# EAGLE design CallerID_V12 (EAGLE 9.3.0)
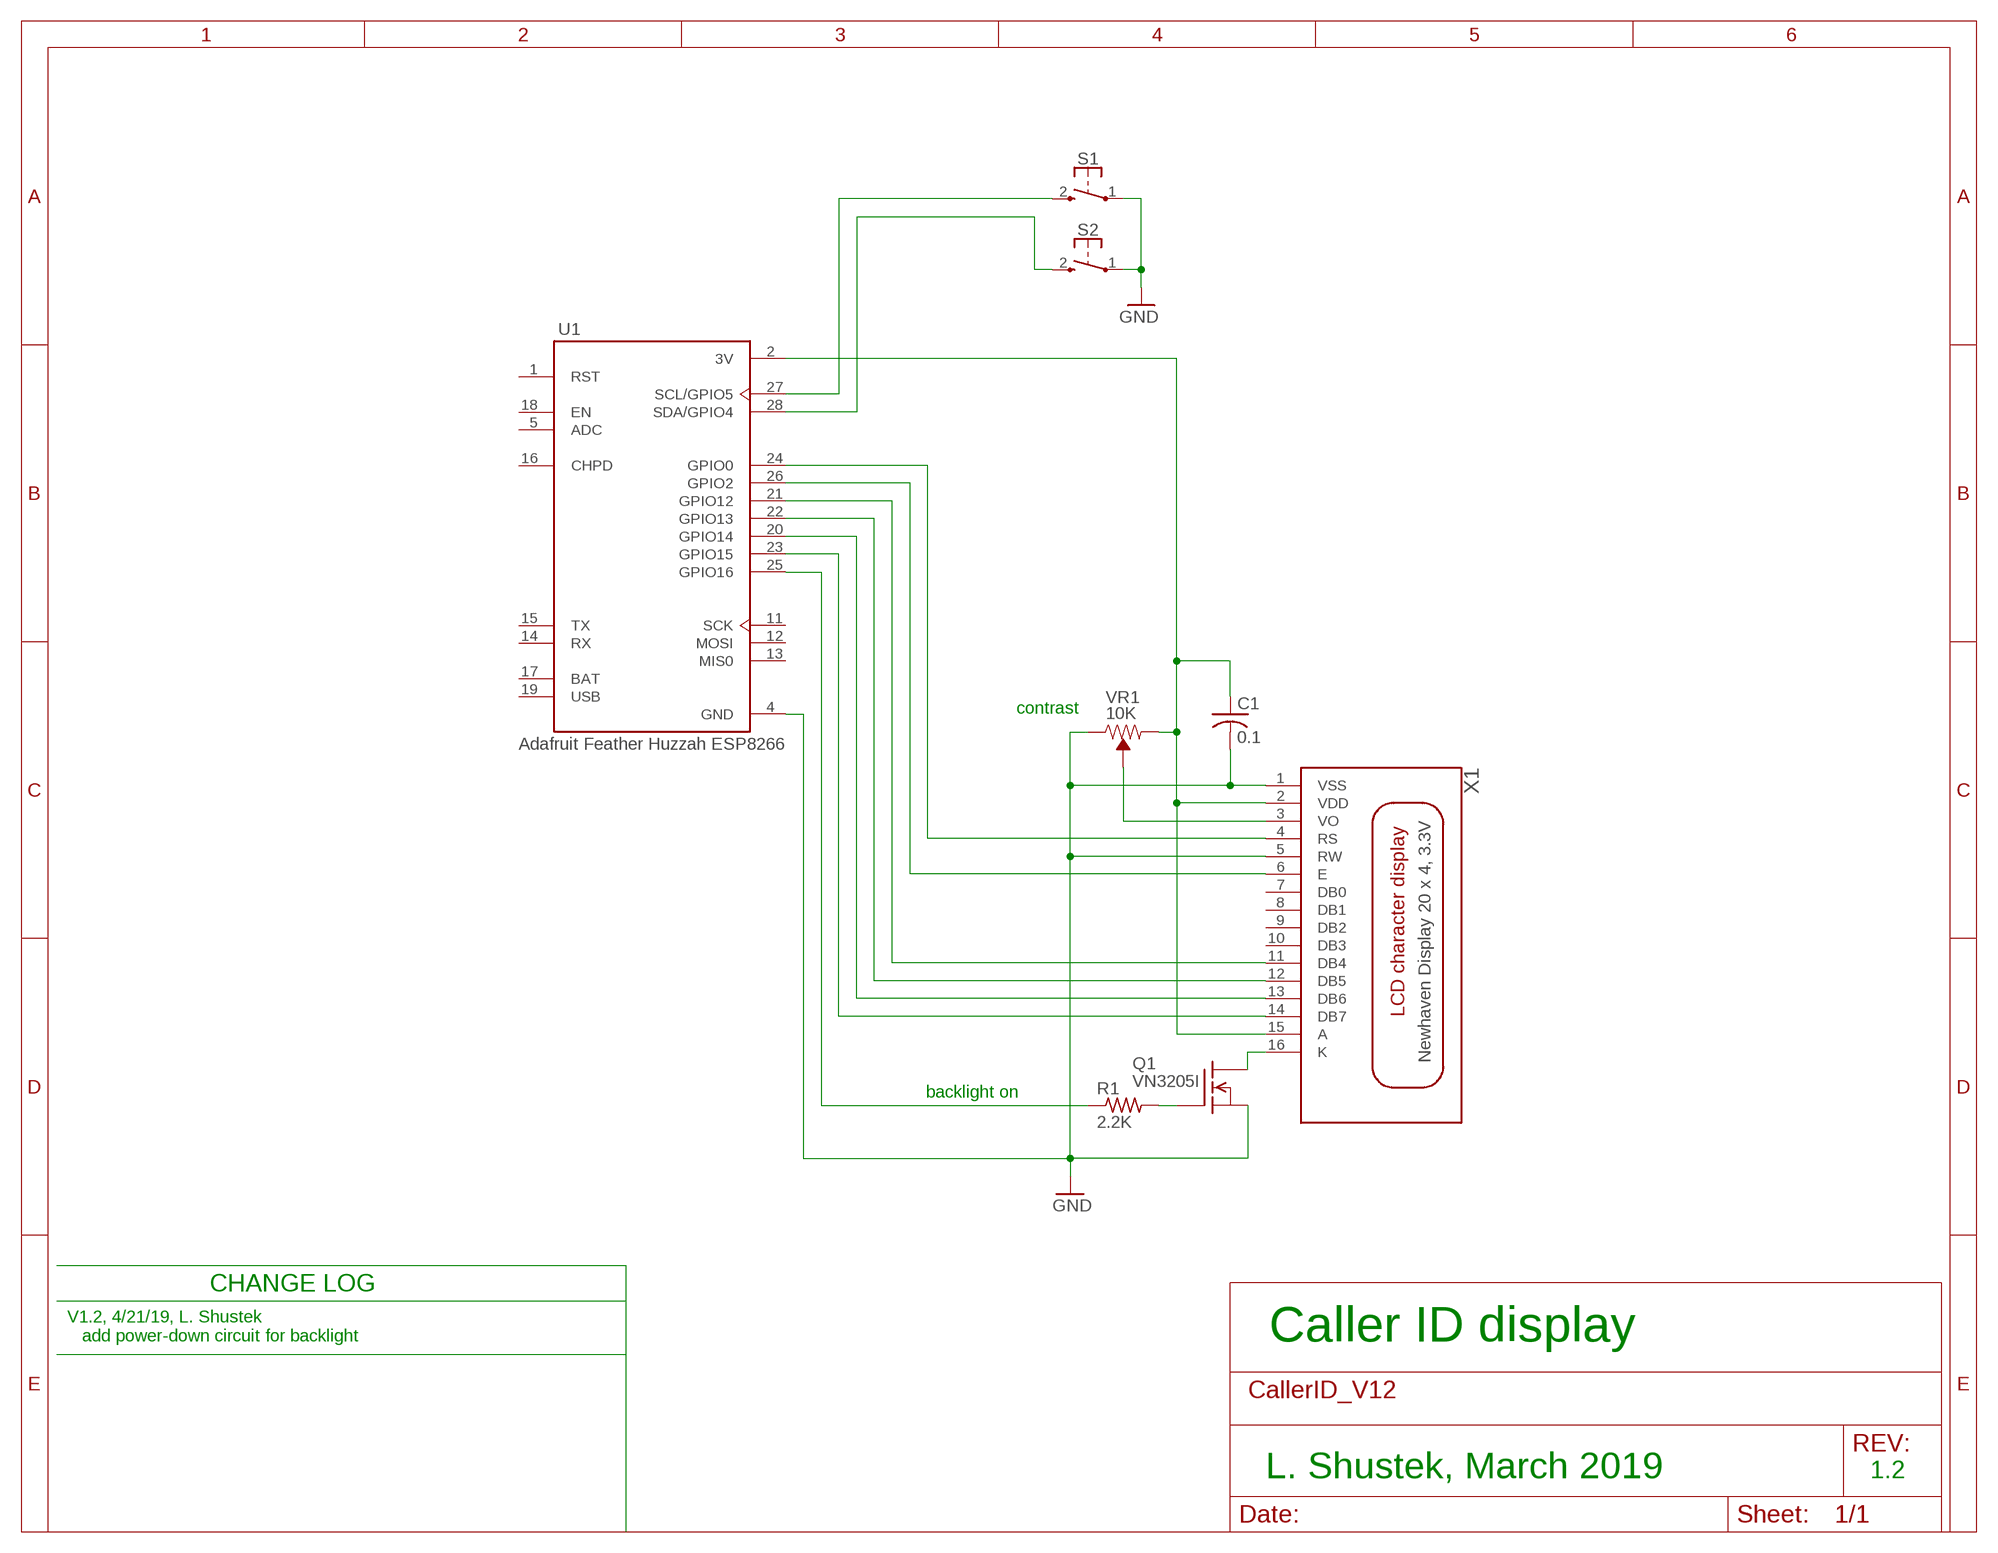
[diagram p0: schematic, sheet 1]

## Parts
C1  0.1  C-US050-024X044  [C050-024X044]
Q1  VN3205I  [TO92-INLINE]
R1  2.2K  R-US_0207/10  [0207/10]
S1  PUSHBUTTON-SPST  [PUSHBUTTON-SPST]
S2  PUSHBUTTON-SPST  [PUSHBUTTON-SPST]
U1  Adafruit Feather Huzzah ESP8266  ADAFRUIT-FEATHER-WIFI  [ADAFRUIT-FEATHER-WIFI]
VR1  10K  TRIMPOT  [TRIMBOT-BOURNS-3362M]
X1  Newhaven Display 20 x 4, 3.3V  LCD-CHARACTER-DISPLAYLCD-CHARACTER-DISPLAY-20X4-NEWHAVEN  [LCD-CHARACTER-DISPLAY-20X4-NEWHAVEN]

## Nets
GND: C1.2 Q1.1(S) S1.1 S2.1 U1.4(GND) VR1.3(CW) X1.1(VSS) X1.5(RW)
N$1: VR1.2(WIPER) X1.3(VO)
N$2: Q1.3(D) X1.16(K)
N$3: S1.2 U1.27(SCL/GPIO5)
N$4: S2.2 U1.28(SDA/GPIO4)
N$5: U1.23(GPIO15) X1.14(DB7)
N$6: U1.20(GPIO14) X1.13(DB6)
N$7: U1.22(GPIO13) X1.12(DB5)
N$8: U1.21(GPIO12) X1.11(DB4)
N$9: U1.26(GPIO2) X1.6(E)
N$10: U1.24(GPIO0) X1.4(RS)
N$11: R1.1 U1.25(GPIO16)
N$12: Q1.2(G) R1.2
VDD: C1.1 U1.2(3V) VR1.1(CCW) X1.2(VDD) X1.15(A)
Unconnected: U1.1(RST) U1.5(ADC) U1.11(SCK) U1.12(MOSI) U1.13(MIS0) U1.14(RX) U1.15(TX) U1.16(CHPD) U1.17(BAT) U1.18(EN) U1.19(USB) X1.7(DB0) X1.8(DB1) X1.9(DB2) X1.10(DB3)

## Notes on the sheet
- contrast
- backlight on
- CHANGE LOG
- V1.2, 4/21/19, L. Shustek
     add power-down circuit for backlight
- Caller ID display
- L. Shustek, March 2019 | 1.2

## Library data of the parts
C1 = adafruit:C-US: CAPACITOR, American symbol
Q1 = Len:VN3205: N-Channel Enhancement MOSFET 500V, 0.4A, 6.0 Ohm
R1 = resistor:R-US_: RESISTOR, American symbol
S1 S2 = Len:PUSHBUTTON-SPST: Momentary Switch (Pushbutton) - SPST - Two Circuits Normally-open (NO) SPST momentary switches
U1 = Len:ADAFRUIT-FEATHER-WIFI: Adafruit Feather HUZZAH with ESP8266 WiFi; AVAILABILITY: Unavailable; DESCRIPTION: Adafruit Feather HUZZAH with ESP8266 WiFi; MF: Adafruit Industries; MP: 2821; PACKAGE: None; PRICE: None
VR1 = Len:TRIMPOT: Trimming Potentiometer (Trimpot) Three-terminal potentiometers, with an adjustable wiper and two adjustable resistors. A pot can be used to create a configurable voltage divider, or as a variable resistor. "Trimpots" are a subset of potentiometers, usually intended for "set-and-forget" applications. They're often more delicate than standard potentiometers - rated for fewer turns. Variants PTH-KNOB - PTH Trimpot w/ finger-adjustable knob Trimpot 10K with Knob <https://www.sparkfun.com/products/9806> (COM-09806) Datasheet <http://www.sparkfun.com/datasheets/Components/General/TSR-3386.pdf> SMD-3MM-CLOSED-FRAME - SMD 3mm Square Closed-Frame Trimpot Used on e.g. EasyDriver - Stepper Motor Driver <https://www.sparkfun.com/products/12779> Datasheet <http://www.bitechnologies.com/pdfs/22.pdf> (22AR10KTR) SMD-5MM - SMD 5mm Square Closed-Frame Trimpot Used on e.g. IOIO-OTG - V2.2 <https://www.sparkfun.com/products/13613> Datasheet <http://www.vishay.com/docs/51008/ts53.pdf> (TS53YL502MR10) SMD-3MM-1/10W-25% - 3mm Square Open-Frame Trimpot Used on e.g. SparkFun Shapeoko <https://www.sparkfun.com/products/13899> Datasheet <http://www.bourns.com/docs/Product-Datasheets/TC33.pdf> (TC33X-2-103E)
X1 = Len:LCD-CHARACTER-DISPLAY: HD44780 LCD Standard character type LCDs, available in sizes from 8x1 to 40x4!

## Net classes
0 default: width 0.381 mm, clearance 0.381 mm

## Board
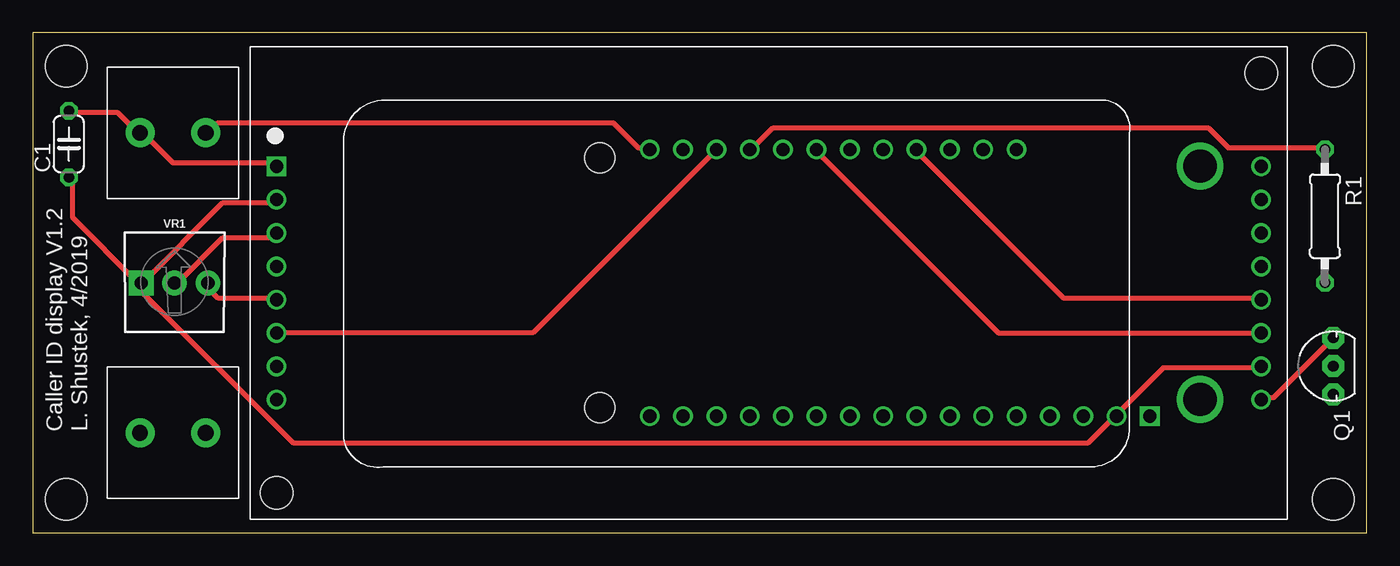
[diagram p1: board, top side]
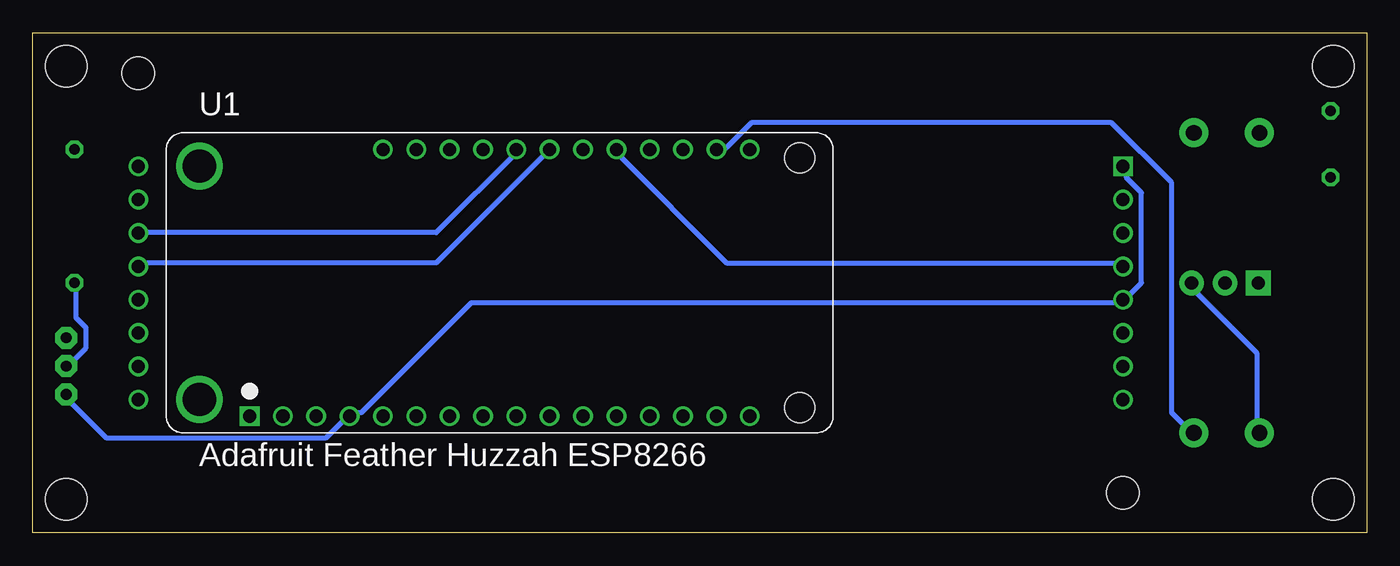
[diagram p2: board, bottom side, seen from below]

Size 101.6 x 38.1 mm. Coordinates in mm from the lower left corner, seen from the top.
Outline: 0,0 101.6,0 101.6,38.1 0,38.1 0,0
Copper layers (1*16): Top 0.035mm / dielectric 1.5mm / Bottom 0.035mm
Design rules "CallerID_design_rules": minimum track width 15mil, minimum drill 0.35mm, track to track 15mil, track to pad 15mil, pad to pad 15mil, via to via 15mil, smd to smd 15mil, copper to edge 40mil, drill to drill 50mil, minimum pad ring 10mil, minimum via ring 8mil, stop-mask expansion 4mil, vias tented up to drill 0mil, thermal gap 10mil
Holes 3.17 mm at 2.54,2.54 2.54,35.56 99.06,35.56 99.06,2.54

### Footprints (pad centres in the part's own frame; a part is rotated, then mirrored left to right if it is on the bottom)
C050-024X044 = drill 0.813 octagon: 1 -2.54,0; 2 2.54,0
TO92-INLINE = drill 0.813 pad 1.676 octagon: 1 -2.159,0; 2 0,0; 3 2.159,0
0207/10 = drill 0.813 octagon: 1 -5.08,0; 2 5.08,0
PUSHBUTTON-SPST = drill 1.2 pad 2.2: 1 -2.5,0; 2 2.5,0
ADAFRUIT-FEATHER-WIFI = drill 1 square: 1 -19.05,-10.16 | drill 1: 2 -16.51,-10.16; 3 -13.97,-10.16; 4 -11.43,-10.16; 5 -8.89,-10.16; 6 -6.35,-10.16; 7 -3.81,-10.16; 8 -1.27,-10.16; 9 1.27,-10.16; 10 3.81,-10.16; 11 6.35,-10.16; 12 8.89,-10.16; 13 11.43,-10.16; 14 13.97,-10.16; 15 16.51,-10.16; 16 19.05,-10.16; 17 -8.89,10.16; 18 -6.35,10.16; 19 -3.81,10.16; 20 -1.27,10.16; 21 1.27,10.16; 22 3.81,10.16; 23 6.35,10.16; 24 8.89,10.16; 25 11.43,10.16; 26 13.97,10.16; 27 16.51,10.16; 28 19.05,10.16 | drill 2.54: PS1 -22.86,-8.89; PS2 -22.86,8.89 | hole 2.286: 22.86,-9.525; 22.86,9.525
TRIMBOT-BOURNS-3362M = drill 1.016 pad 1.88 square: 1 -2.54,-0.015 | drill 1.016 pad 1.88: 2 0,-0.015; 3 2.54,-0.015
LCD-CHARACTER-DISPLAY-20X4-NEWHAVEN = drill 1 square: 1 2,26.89 | drill 1: 2 2,24.35; 3 2,21.81; 4 2,19.27; 5 2,16.73; 6 2,14.19; 7 2,11.65; 8 2,9.11; 9 77,26.89; 10 77,24.35; 11 77,21.81; 12 77,19.27; 13 77,16.73; 14 77,14.19; 15 77,11.65; 16 77,9.11 | hole 2.5: 2,2; 77,34

### Placement (x,y rotation side)
C1  2.75,29.62 90 top
Q1  99.06,12.7 90 top
R1  98.42,24.13 270 top
S1  10.67,7.62 0 top
S2  10.67,30.48 0 top
U1  66.04,19.05 0 bottom
VR1  10.79,19.05 0 top
X1  16.56,1.03 0 top

### Tracks (layer width: path | path; a pad name or v marks a point on that pad's centre or on a via)
GND
  Top 0.381: C1.2 3.05,32 6.48,32 8,30.48 S2.1 8.38,30.48 10.67,28.19 18.29,28.19 X1.1 | X1.5 18.29,17.91 14.1,17.91 13.34,18.67 VR1.3
  Bottom 0.381: Q1.1 99.06,10.29 96.01,7.24 79.25,7.24 77.72,8.76 U1.4 77.34,9.14 76.58,9.14 68.2,17.53 18.67,17.53 X1.5 18.29,17.91 17.14,19.05 17.14,25.91 18.29,27.05 18.29,27.81 X1.1 | S1.1 8.38,7.62 8.38,13.72 13.34,18.67 VR1.3
N$1
  Top 0.381: X1.3 18.29,22.48 14.48,22.48 11.05,19.05 VR1.2
N$2
  Top 0.381: Q1.3 94.49,10.29 93.73,10.29 X1.16
N$3
  Bottom 0.381: U1.27 49.53,29.34 48.77,29.34 46.86,31.24 19.43,31.24 14.86,26.67 14.86,9.14 13.34,7.62 S1.2
N$4
  Top 0.381: U1.28 46.86,29.34 46.1,29.34 44.2,31.24 14.1,31.24 13.34,30.48 S2.2
N$5
  Top 0.381: X1.14 93.34,15.24 73.53,15.24 59.82,28.96 U1.23
N$6
  Top 0.381: X1.13 93.34,17.91 78.49,17.91 67.44,28.96 U1.20
N$7
  Bottom 0.381: U1.22 70.87,20.57 93.34,20.57 X1.12
N$8
  Bottom 0.381: X1.11 93.34,22.86 70.87,22.86 64.77,28.96 U1.21
N$9
  Top 0.381: U1.26 38.1,15.24 18.67,15.24 X1.6
N$10
  Bottom 0.381: X1.4 18.67,20.57 48.77,20.57 57.15,28.96 U1.24
N$11
  Top 0.381: R1.1 98.3,29.34 91.06,29.34 89.53,30.86 56.39,30.86 54.86,29.34 U1.25
N$12
  Bottom 0.381: R1.2 98.3,19.05 98.3,16.38 97.54,15.62 97.54,14.1 99.06,12.57 Q1.2
VDD
  Top 0.381: X1.15 93.34,12.57 86.11,12.57 82.68,9.14 U1.2 82.3,8.76 80.39,6.86 19.81,6.86 8,18.67 VR1.1 | C1.1 3.05,27.05 3.05,24 8,19.05 VR1.1 | X1.2 18.29,25.15 14.48,25.15 8.38,19.05 VR1.1

### Text on the board
tPlace: Caller ID display V1.2 / L. Shustek, 4/2019